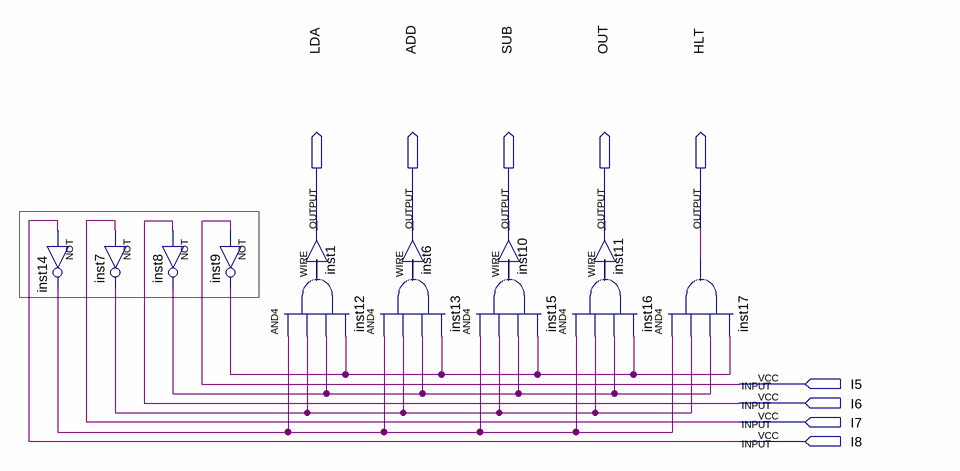
[diagram p0: schematic sheet]
// Quartus schematic decoder_of_instructions.bdf as structural Verilog: 13 symbols, 9 pins
module decoder_of_instructions (
  input  I5,
  input  I6,
  input  I7,
  input  I8,
  output LDA,
  output ADD,
  output SUB,
  output OUT,
  output HLT
);

  wire inst7_out, inst8_out, inst9_out, inst12_out, inst13_out, inst14_out, inst15_out, inst16_out;

  not inst14 (inst14_out, I8);
  not inst7 (inst7_out, I7);
  not inst8 (inst8_out, I6);
  not inst9 (inst9_out, I5);
  assign LDA = inst12_out;  // WIRE inst1
  and inst12 (inst12_out, inst14_out, inst7_out, inst8_out, inst9_out);
  and inst13 (inst13_out, inst14_out, inst7_out, inst8_out, inst9_out);
  assign ADD = inst13_out;  // WIRE inst6
  and inst15 (inst15_out, inst14_out, inst7_out, inst8_out, inst9_out);
  assign SUB = inst15_out;  // WIRE inst10
  assign OUT = inst16_out;  // WIRE inst11
  and inst16 (inst16_out, inst14_out, inst7_out, inst8_out, inst9_out);
  and inst17 (HLT, inst14_out, inst7_out, inst8_out, inst9_out);
endmodule
